# Altium project LTC2949_TestBoard.PrjPcb
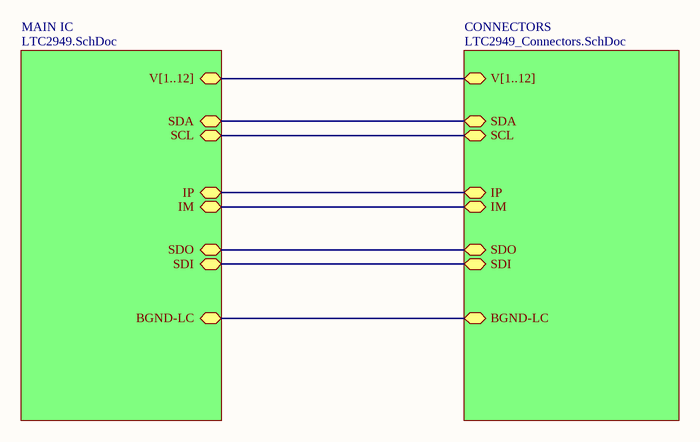
[diagram p0: TopLevel.SchDoc]
3 sheets, 50 parts. Net scope: hierarchical (ports join the sheet entries above them; power ports are global).
Board file: PCB1-LTC2949-V1.PcbDoc
Sheets:
  TopLevel.SchDoc
    MAIN IC = LTC2949.SchDoc
    CONNECTORS = LTC2949_Connectors.SchDoc

## Sheet TopLevel.SchDoc: LTC2949 Top Level
size A4; Author: Leo Xie & Naveela Sookoo; Organization: Waterloop; Address1: 200 University Avenue W; Address2: Engineering 5, 1104; Address3: Waterloo, Ontario; Address4: N2L 3G1; DocumentNumber: 1; Revision: 1; SheetNumber: 1; SheetTotal: 3

### Sub-sheets
CONNECTORS = LTC2949_Connectors.SchDoc: V[1..12] (bidir), SDA (bidir), SCL (bidir), BGND-LC (bidir), IP (bidir), IM (bidir), SDO (bidir), SDI (bidir)
MAIN IC = LTC2949.SchDoc: V[1..12] (bidir), SDA (bidir), SCL (bidir), BGND-LC (bidir), IP (bidir), IM (bidir), SDO (bidir), SDI (bidir)

### Nets
TX_N: sheet MAIN IC/IP, sheet CONNECTORS/IP
TX_P: sheet MAIN IC/IM, sheet CONNECTORS/IM
NetP1_3: sheet MAIN IC/SDO, sheet CONNECTORS/SDO
NetP1_4: sheet MAIN IC/SDI, sheet CONNECTORS/SDI
NetP2_2: sheet MAIN IC/SDA, sheet CONNECTORS/SDA
NetP2_3: sheet MAIN IC/SCL, sheet CONNECTORS/SCL
NetP7_2: sheet MAIN IC/BGND-LC, sheet CONNECTORS/BGND-LC

### Buses and harness runs
bus sheet CONNECTORS/V[1..12] = sheet MAIN IC/V[1..12]

### Notes on the sheet
- Title:
- Size:
- Date:
- A4
- Author:
- Revision:
- Sheet
- of
- File:

## Sheet LTC2949.SchDoc: LTC2949 Test Board
size A4; Author: Leo Xie & Naveela Sookoo; Organization: Waterloop; Address1: 200 University Avenue W; Address2: Engineering 5 ,1104; Address3: Waterloo, Ontario; Address4: N2L 3G1; DocumentNumber: 2; Revision: 1; SheetNumber: 2; SheetTotal: 3
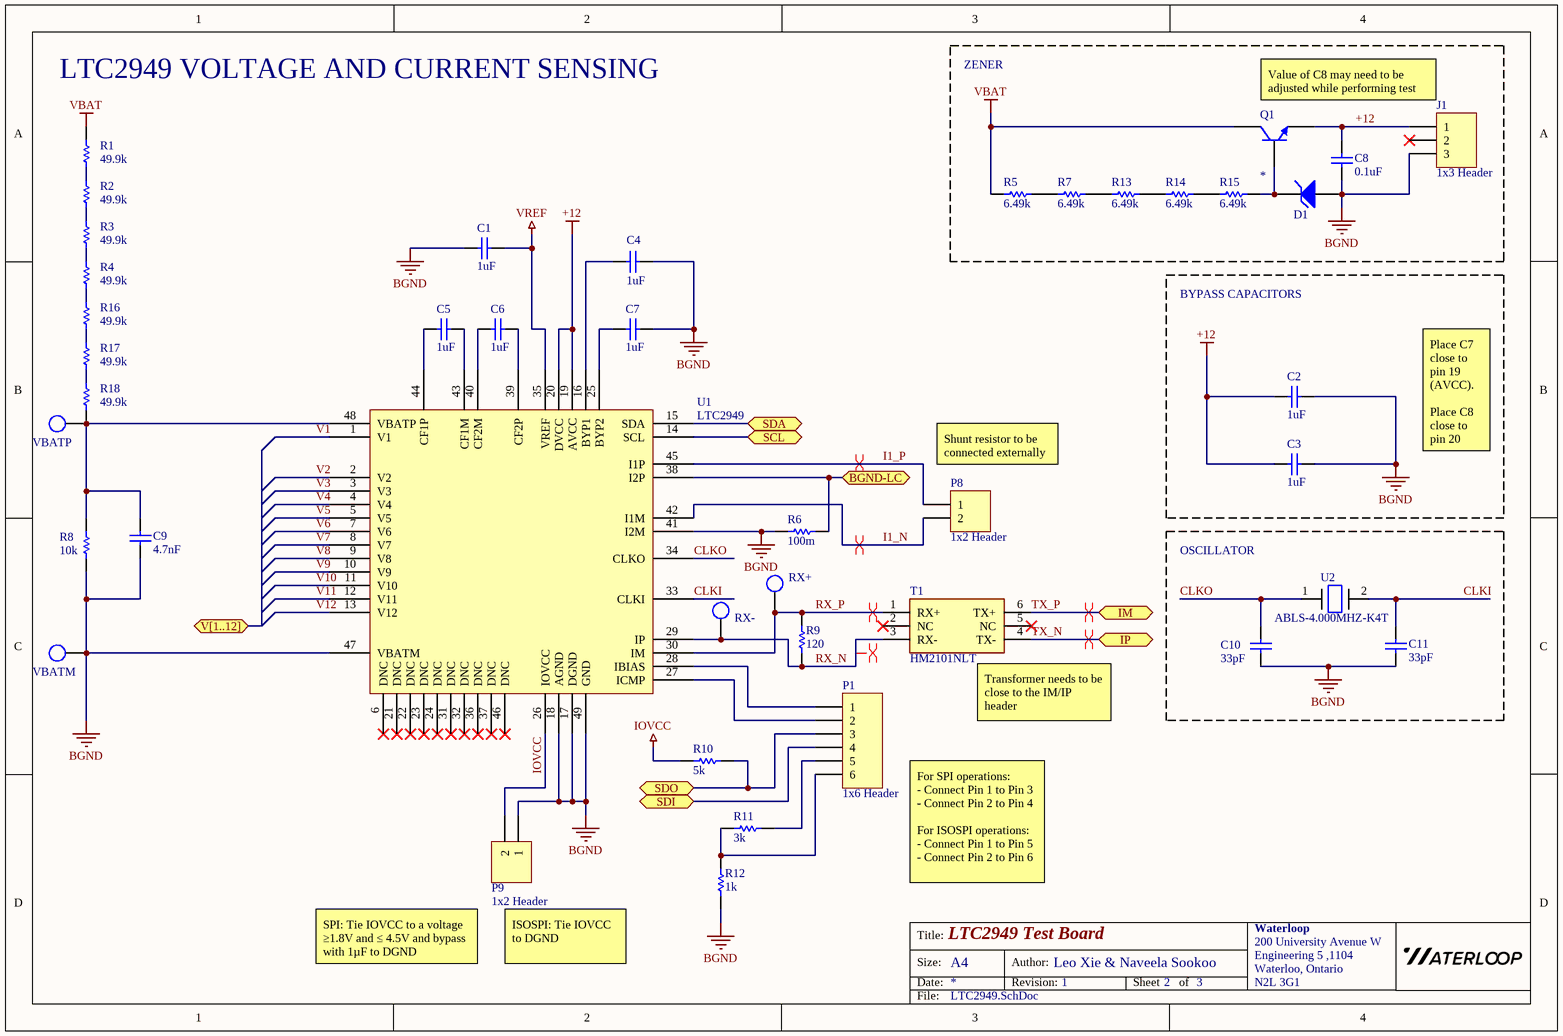
[diagram p1: LTC2949.SchDoc]

### Parts
C1  value 1uF  [0805 - Capacitor]  (hidden comment: Capacitor - Nonpolarized)
C2  value 1uF  [0805 - Capacitor]  (hidden comment: Nonpolarized Capacitor)
C3  value 1uF  [0805 - Capacitor]  (hidden comment: Nonpolarized Capacitor)
C4  value 1uF  [0805 - Capacitor]  (hidden comment: Nonpolarized Capacitor)
C5  value 1uF  [0805 - Capacitor]  (hidden comment: Nonpolarized Capacitor)
C6  value 1uF  [0805 - Capacitor]  (hidden comment: Nonpolarized Capacitor)
C7  value 1uF  [0805 - Capacitor]  (hidden comment: Nonpolarized Capacitor)
C8  value 0.1uF  [0805 - Capacitor]  (hidden comment: Nonpolarized Capacitor)
C9  value 4.7nF  [0805 - Capacitor]  (hidden comment: Nonpolarized Capacitor)
C10  value 33pF  [0805 - Capacitor]  (hidden comment: Nonpolarized Capacitor)
C11  value 33pF  [0805 - Capacitor]  (hidden comment: Nonpolarized Capacitor)
D1  Zener  [BZD27C - ZENER DIODES]  (value not drawn)
J1  1x3 Header  [HDR1X3]
P1  1x6 Header  [HDR1X6]
P8  1x2 Header  [HDR1X2]
P9  1x2 Header  [HDR1X2]
Q1  NPN  [BJT NPN 800 V 4 A - 90 W Through Hole TO-220]  (value not drawn)
R1  value 49.9k  [1206 - Resistor]  (hidden comment: Resistor)
R2  value 49.9k  [1206 - Resistor]  (hidden comment: Resistor)
R3  value 49.9k  [1206 - Resistor]  (hidden comment: Resistor)
R4  value 49.9k  [1206 - Resistor]  (hidden comment: Resistor)
R5  value 6.49k  [0603 - Resistor]  (hidden comment: Resistor)
R6  value 100m  [0603 - Resistor]  (hidden comment: Resistor)
R7  value 6.49k  [0603 - Resistor]  (hidden comment: Resistor)
R8  value 10k  [0603 - Resistor]  (hidden comment: Resistor)
R9  value 120  [0603 - Resistor]  (hidden comment: Resistor)
R10  value 5k  [0603 - Resistor]  (hidden comment: Resistor)
R11  value 3k  [0603 - Resistor]  (hidden comment: Resistor)
R12  value 1k  [0603 - Resistor]  (hidden comment: Resistor)
R13  value 6.49k  [0603 - Resistor]  (hidden comment: Resistor)
R14  value 6.49k  [0603 - Resistor]  (hidden comment: Resistor)
R15  value 6.49k  [0603 - Resistor]  (hidden comment: Resistor)
R16  value 49.9k  [1206 - Resistor]  (hidden comment: Resistor)
R17  value 49.9k  [1206 - Resistor]  (hidden comment: Resistor)
R18  value 49.9k  [1206 - Resistor]  (hidden comment: Resistor)
RX+  Test Point  [Test Point - 5002]  (value not drawn)  (no BOM)
RX-  Test Point  [Test Point - 5002]  (value not drawn)  (no BOM)
T1  HM2101NLT  [HM2101NLT]
U1  LTC2949  [LTC2949]
U2  ABLS-4.000MHZ-K4T  [ABLS_4MHZ-K4T]
VBATM  Test Point  [Test Point - 5002]  (value not drawn)  (no BOM)
VBATP  Test Point  [Test Point - 5002]  (value not drawn)  (no BOM)

### Blocks framed on the sheet
ZENER: C8 D1 J1 Q1 R5 R7 R13-R15
BYPASS CAPACITORS: C2 C3
OSCILLATOR: C10 C11 U2

### Ports
BGND-LC (bidir), IM (bidir), IP (bidir), SCL (bidir), SDA (bidir), SDI (bidir), SDO (bidir), V[1..12] (bidir)

### Nets
+12: C2.1 C3.1 C8.1 J1.1 Q1.3(E) U1.19(AVCC) U1.20(DVCC)
BGND: C1.1 C2.2 C3.2 C4.2 C7.2 C8.2 C9.1 C10.1 C11.1 D1.1(A) J1.3 P9.1 R6.1 R8.1 R12.2 U1.17(DGND) U1.18(AGND) U1.41(I2M) U1.47(VBATM) U1.49(GND) VBATM.1
IOVCC: P9.2 R10.1 U1.26(IOVCC)
VBAT: Q1.1(C) R1.2 R5.2
VREF: C1.2 U1.35(VREF)
CLKI: C11.2 U1.33(CLKI) U2.2
CLKO: C10.2 U1.34(CLKO) U2.1
I1_N: P8.2 U1.42(I1M)
I1_P: P8.1 U1.45(I1P)
RX_N: R9.1 RX-.1 T1.3(RX-) U1.29(IP)
RX_P: R9.2 RX+.1 T1.1(RX+) U1.30(IM)
TX_N: T1.4(TX-) ; port IP
TX_P: T1.6(TX+) ; port IM
V1: U1.1(V1)
V2: U1.2(V2)
V3: U1.3(V3)
V4: U1.4(V4)
V5: U1.5(V5)
V6: U1.7(V6)
V7: U1.8(V7)
V8: U1.9(V8)
V9: U1.10(V9)
V10: U1.11(V10)
V11: U1.12(V11)
V12: U1.13(V12)
NetC4_1: C4.1 U1.16(BYP1)
NetC5_1: C5.1 U1.44(CF1P)
NetC5_2: C5.2 U1.43(CF1M)
NetC6_1: C6.1 U1.40(CF2M)
NetC6_2: C6.2 U1.39(CF2P)
NetC7_1: C7.1 U1.25(BYP2)
NetC9_2: C9.2 R8.2 R18.1 U1.48(VBATP) VBATP.1
NetD1_2: D1.2(K) Q1.2(B) R15.1
NetP1_1: P1.1 U1.28(IBIAS)
NetP1_2: P1.2 U1.27(ICMP)
NetP1_3: P1.3 R10.2 ; port SDO
NetP1_4: P1.4 ; port SDI
NetP1_5: P1.5 R11.2
NetP1_6: P1.6 R11.1 R12.1
NetP2_2: U1.15(SDA) ; port SDA
NetP2_3: U1.14(SCL) ; port SCL
NetP7_2: R6.2 U1.38(I2P) ; port BGND-LC
NetR1_1: R1.1 R2.2
NetR2_1: R2.1 R3.2
NetR3_1: R3.1 R4.2
NetR4_1: R4.1 R16.2
NetR5_1: R5.1 R7.2
NetR7_1: R7.1 R13.2
NetR13_1: R13.1 R14.2
NetR14_1: R14.1 R15.2
NetR16_1: R16.1 R17.2
NetR17_1: R17.1 R18.2

Not connected (* = marked no-connect by the designer): J1 2*; T1 2(NC)* 5(NC)*; U1 6(DNC)* 21(DNC)* 22(DNC)* 23(DNC)* 24(DNC)* 31(DNC)* 32(DNC)* 36(DNC)* 37(DNC)* 46(DNC)*

### Layout directives
differential pair: I1_N, I1_P, RX_N, RX_P, TX_N, TX_P

### Notes on the sheet
- LTC2949 VOLTAGE AND CURRENT SENSING
- Value of C8 may need to be adjusted while performing test
- Place C7 close to pin 19 (AVCC).
  Place C8 close to pin 20 (DVCC).
- (near P8) Shunt resistor to be connected externally
- (near T1) Transformer needs to be close to the IM/IP header
- For SPI operations:
  - Connect Pin 1 to Pin 3
  - Connect Pin 2 to Pin 4
  For ISOSPI operations:
  - Connect Pin 1 to Pin 5
  - Connect Pin 2 to Pin 6
- SPI: Tie IOVCC to a voltage ≥1.8V and ≤ 4.5V and bypass with 1µF to DGND
- ISOSPI: Tie IOVCC to DGND
- Title:
- Size:
- Date:
- A4
- Author:
- Revision:
- Sheet
- of
- File:

### Library data of the parts
C1 = Capacitor - Nonpolarized: Nonpolarized Capacitor; Supplier Part Number: *; Supplier: *; Manufacturer: *; Rating: *; Manufacturer Part Number: *
C2-C11 = Capacitor - Nonpolarized: Supplier Part Number: *; Supplier: *; Manufacturer: *; Rating: *; Manufacturer Part Number: *
D1 = Zener: Zener Diode; Manufacturer Part Number: *; Manufacturer: *; Supplier: *; Supplier Part Number: *; Value: *
J1 = 1x3 Header: 1x3 Pin Header
P1 = 1x6 Header: 1x6 Pin Header
P8 P9 = 1x2 Header: 1x2 Pin Header
Q1 = NPN: NPN Bipolar Transistor; Rating: *; Manufacturer: *; Manufacturer Part Number: *; Supplier: *; Supplier Part Number: *; Value: *
T1 = HM2101NLT: Pulse Transformer 1:1 Surface Mount 150µH, 450µH
U1 = LTC2949: Manufacturer: Analog Devices; Manufacturer Part Number: LTC2949ILXE#3ZZPBF; Supplier: Mouser; Supplier Part Number: 584-2949ILXE3ZZPBF
U2 = ABLS-4.000MHZ-K4T: Crystal Oscillator 4MHz 18pF
R1-R18 = Resistor: Rating: *; Manufacturer Part Number: *; Manufacturer: *; Supplier Part Number: *; Supplier: *

## Sheet LTC2949_Connectors.SchDoc: LTC2949 Connectors
size A4; Author: Leo Xie & Naveela Sookoo; Organization: Waterloop; Address1: 200 University Avenue W; Address2: Engineering 5, 1104; Address3: Waterloo, Ontario; Address4: N2L 3G1; DocumentNumber: 3; Revision: 1; SheetNumber: 3; SheetTotal: 3
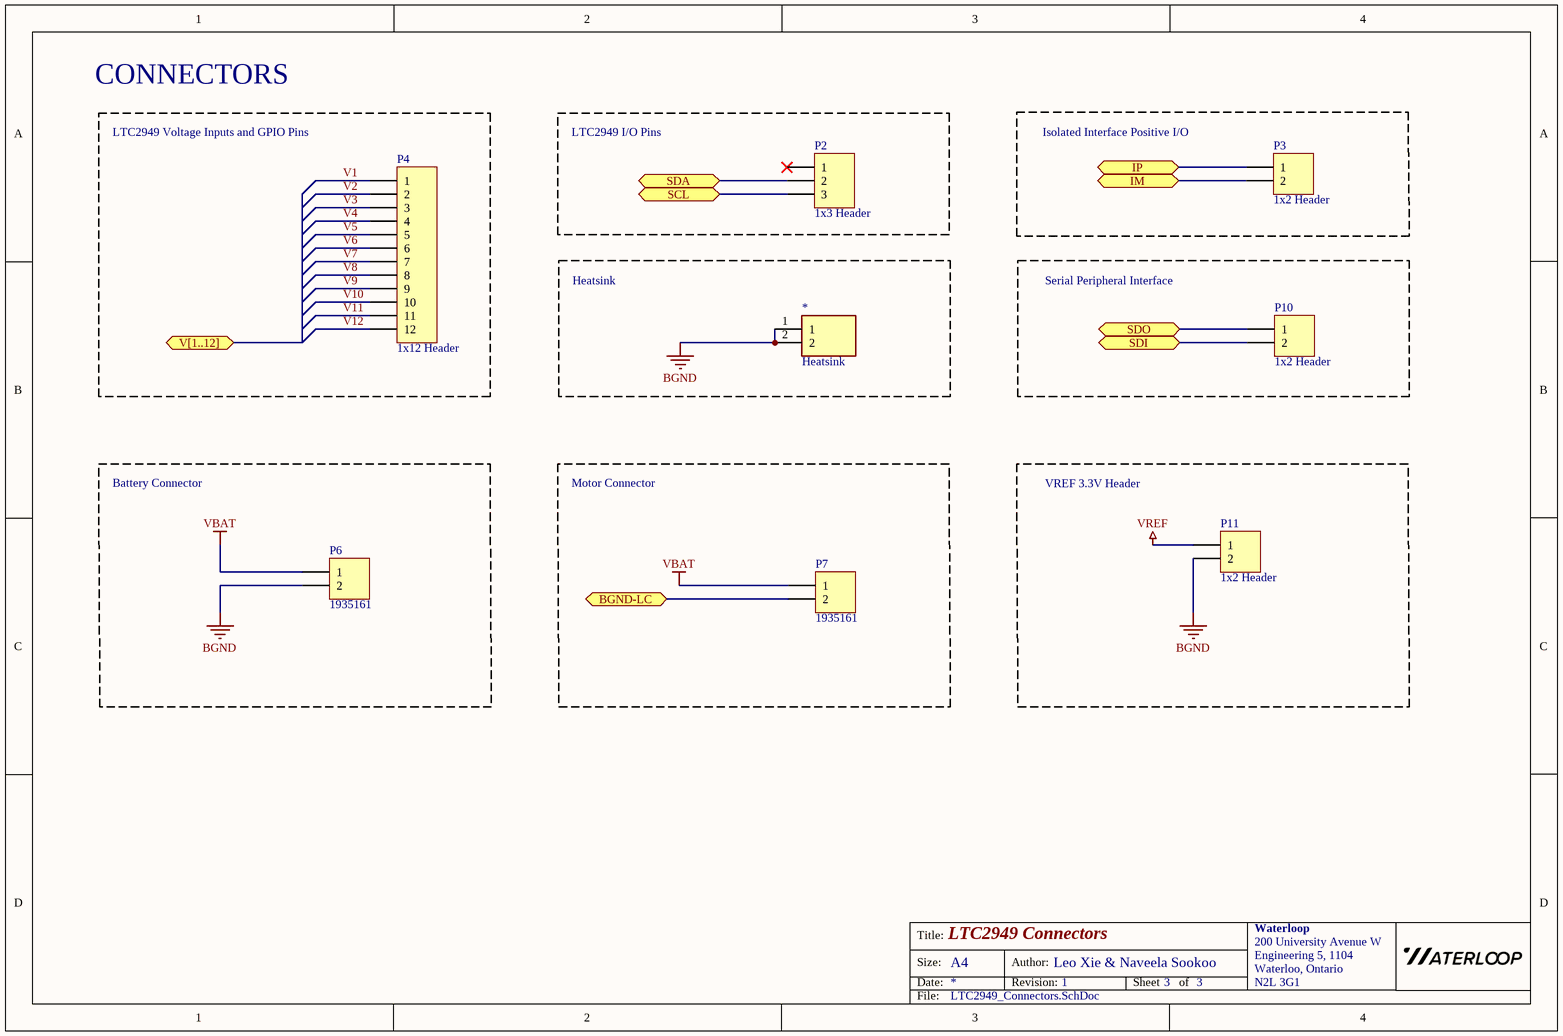
[diagram p2: LTC2949_Connectors.SchDoc]

### Parts
*  Heatsink  [10C/W Vertical Heatsink with Pins for TO-220]
P2  1x3 Header  [HDR1X3]
P3  1x2 Header  [HDR1X2]
P4  1x12 Header  [HDR1X12]
P6  1935161  [1935161]
P7  1935161  [1935161]
P10  1x2 Header  [HDR1X2]
P11  1x2 Header  [HDR1X2]

### Blocks framed on the sheet
LTC2949 Voltage Inputs and GPIO Pins: P4
LTC2949 I/O Pins: P2
Isolated Interface Positive I/O: P3
Heatsink: *
Serial Peripheral Interface: P10
Battery Connector: P6
Motor Connector: P7

### Ports
BGND-LC (bidir), IM (bidir), IP (bidir), SCL (bidir), SDA (bidir), SDI (bidir), SDO (bidir), V[1..12] (bidir)

### Nets
BGND: *.1 *.2 P6.2 P11.2
VBAT: P6.1 P7.1
VREF: P11.1
TX_N: P3.1 ; port IP
TX_P: P3.2 ; port IM
V1: P4.1
V2: P4.2
V3: P4.3
V4: P4.4
V5: P4.5
V6: P4.6
V7: P4.7
V8: P4.8
V9: P4.9
V10: P4.10
V11: P4.11
V12: P4.12
NetP1_3: P10.1 ; port SDO
NetP1_4: P10.2 ; port SDI
NetP2_2: P2.2 ; port SDA
NetP2_3: P2.3 ; port SCL
NetP7_2: P7.2 ; port BGND-LC

Not connected (* = marked no-connect by the designer): P2 1*

### Notes on the sheet
- CONNECTORS
- VREF 3.3V Header
- Title:
- Size:
- Date:
- A4
- Author:
- Revision:
- Sheet
- of
- File:

### Library data of the parts
* = Heatsink: Vertical Heatsink for TO-220 Package
P2 = 1x3 Header: 1x3 Pin Header
P3 P10 P11 = 1x2 Header: 1x2 Pin Header
P4 = 1x12 Header: 1x12 Pin Header
P6 P7 = 1935161: 1x2 Screw Terminal Block; Manufacturer: CUI Devices; Manufacturer Part Number: TB002-500-02BE; Supplier: Digikey; Supplier Part Number: 102-6145-ND

## Nets that join several sheets
BGND: LTC2949 (21 pins), LTC2949_Connectors (*.1 *.2 P6.2 P11.2)
VBAT: LTC2949 (Q1.1 R1.2 R5.2), LTC2949_Connectors (P6.1 P7.1)
VREF: LTC2949 (C1.2 U1.35), LTC2949_Connectors (P11.1)
NetP1_3: LTC2949 (P1.3 R10.2), LTC2949_Connectors (P10.1)
NetP1_4: LTC2949 (P1.4), LTC2949_Connectors (P10.2)
NetP2_2: LTC2949 (U1.15), LTC2949_Connectors (P2.2)
NetP2_3: LTC2949 (U1.14), LTC2949_Connectors (P2.3)
NetP7_2: LTC2949 (R6.2 U1.38), LTC2949_Connectors (P7.2)
TX_N: LTC2949 (T1.4), LTC2949_Connectors (P3.1)
TX_P: LTC2949 (T1.6), LTC2949_Connectors (P3.2)